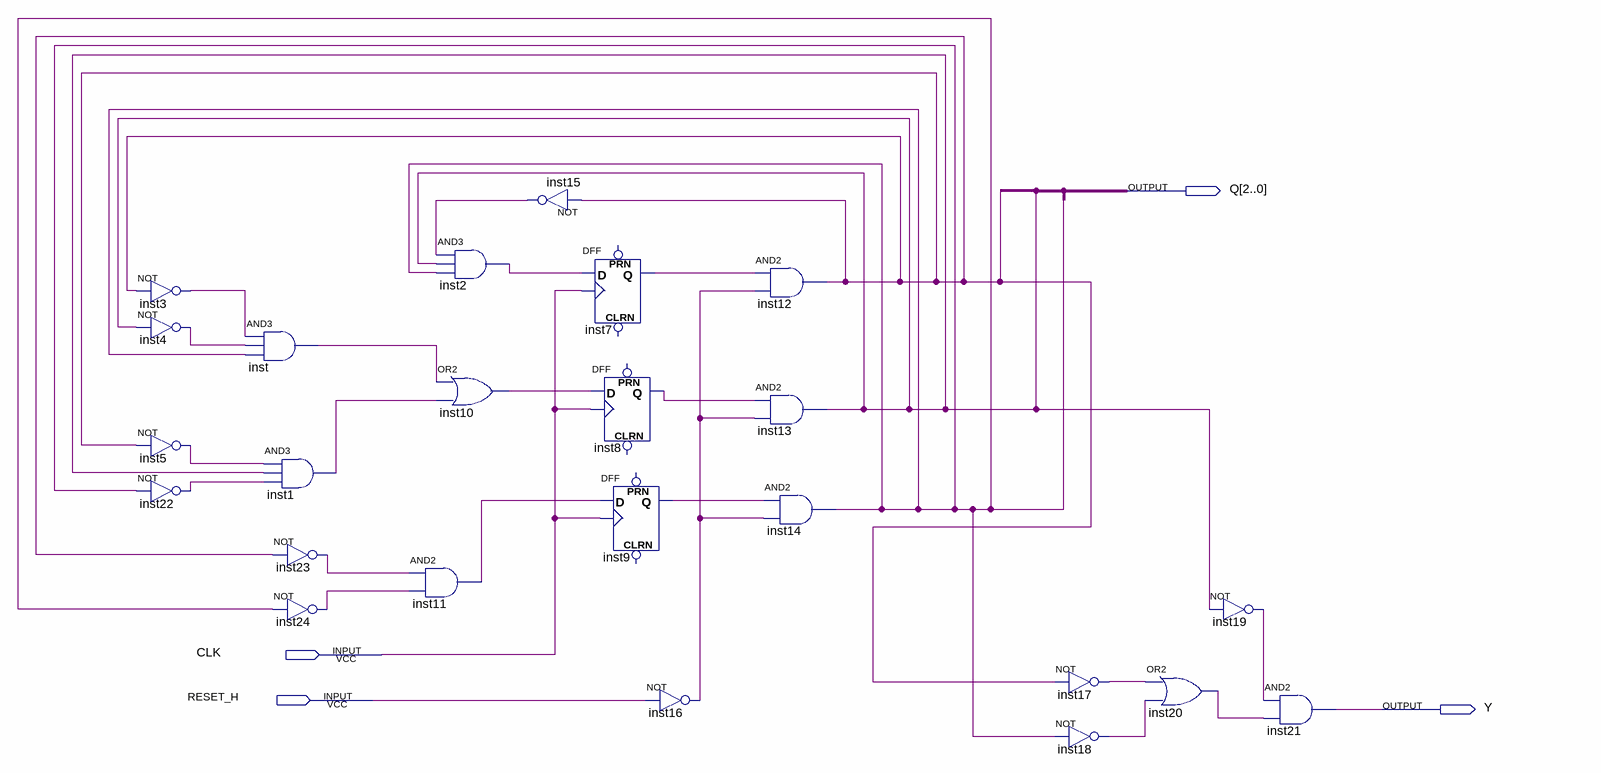
[diagram p0: schematic sheet]
// Quartus schematic enunciado1.bdf as structural Verilog: 24 symbols, 4 pins
module enunciado1 (
  input  CLK,
  input  RESET_H,
  output [2:0] Q,
  output Y
);

  wire inst1_out, inst2_out, inst3_out, inst4_out, inst5_out, inst7_q, inst8_q, inst9_q, inst10_out,
       inst11_out, inst12_out, inst13_out, inst14_out, inst15_out, inst16_out, inst17_out, inst18_out,
       inst19_out, inst20_out, inst22_out, inst23_out, inst24_out, inst_out;

  not inst3 (inst3_out, inst12_out);
  not inst4 (inst4_out, inst13_out);
  not inst5 (inst5_out, inst12_out);
  not inst22 (inst22_out, inst14_out);
  and inst (inst_out, inst3_out, inst4_out, inst14_out);
  and inst1 (inst1_out, inst5_out, inst13_out, inst22_out);
  not inst23 (inst23_out, inst12_out);
  not inst24 (inst24_out, inst14_out);
  and inst11 (inst11_out, inst23_out, inst24_out);
  and inst2 (inst2_out, inst15_out, inst13_out, inst14_out);
  or inst10 (inst10_out, inst_out, inst1_out);
  not inst15 (inst15_out, inst12_out);
  DFF inst7 (.CLK(CLK), .D(inst2_out), .Q(inst7_q));  // open: CLRN, PRN
  DFF inst8 (.CLK(CLK), .D(inst10_out), .Q(inst8_q));  // open: CLRN, PRN
  DFF inst9 (.CLK(CLK), .D(inst11_out), .Q(inst9_q));  // open: CLRN, PRN
  not inst16 (inst16_out, RESET_H);
  and inst12 (inst12_out, inst7_q, inst16_out);
  and inst13 (inst13_out, inst8_q, inst16_out);
  and inst14 (inst14_out, inst9_q, inst16_out);
  not inst17 (inst17_out, inst12_out);
  not inst18 (inst18_out, inst14_out);
  or inst20 (inst20_out, inst17_out, inst18_out);
  not inst19 (inst19_out, inst13_out);
  and inst21 (Y, inst19_out, inst20_out);
endmodule
